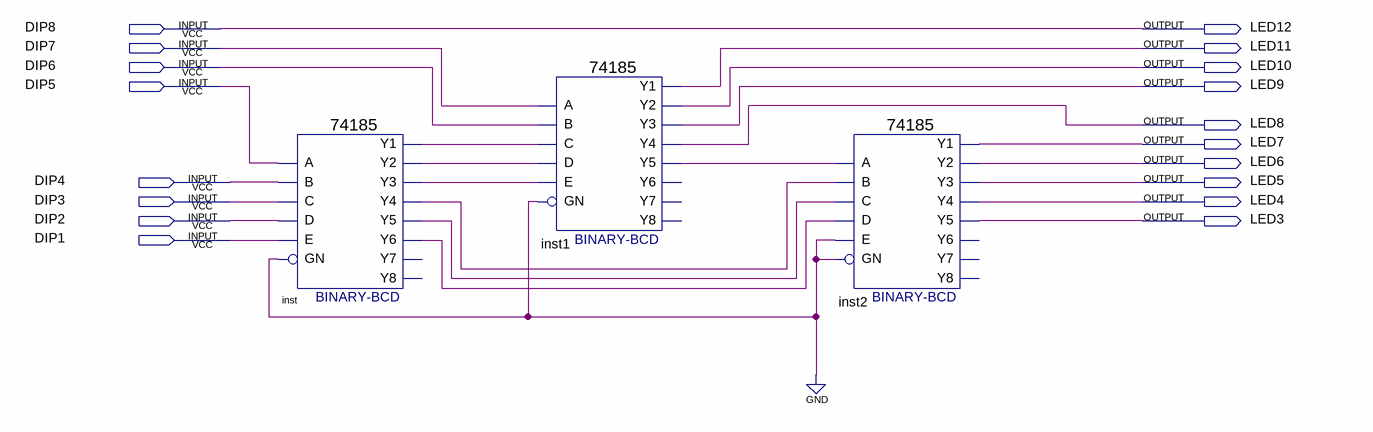
[diagram p0: schematic sheet]
// Quartus schematic EXP1.bdf as structural Verilog: 3 symbols, 18 pins
module EXP1 (
  input  DIP8,
  input  DIP7,
  input  DIP6,
  input  DIP5,
  input  DIP4,
  input  DIP3,
  input  DIP2,
  input  DIP1,
  output LED12,
  output LED11,
  output LED10,
  output LED9,
  output LED8,
  output LED7,
  output LED6,
  output LED5,
  output LED4,
  output LED3
);

  wire inst1_y5, inst_y1, inst_y2, inst_y3, inst_y4, inst_y5, inst_y6;

  \74185  inst (
    .A(DIP5), .B(DIP4), .D(DIP2), .C(DIP3), .E(DIP1), .GN(1'b0), .Y1(inst_y1), .Y3(inst_y3), .Y2(inst_y2),
    .Y5(inst_y5), .Y4(inst_y4), .Y6(inst_y6));  // open: Y8, Y7
  \74185  inst1 (
    .A(DIP7), .B(DIP6), .D(inst_y2), .C(inst_y1), .E(inst_y3), .GN(1'b0), .Y1(LED11), .Y3(LED9), .Y2(LED10),
    .Y5(inst1_y5), .Y4(LED8));  // open: Y6, Y8, Y7
  \74185  inst2 (
    .A(inst1_y5), .B(inst_y4), .D(inst_y6), .C(inst_y5), .E(1'b0), .GN(1'b0), .Y1(LED7), .Y3(LED5),
    .Y2(LED6), .Y5(LED3), .Y4(LED4));  // open: Y6, Y8, Y7

  assign LED12 = DIP8;
endmodule
